# EAGLE design CONTROL circuit LED for Junction Box (EAGLE 9.4.2)
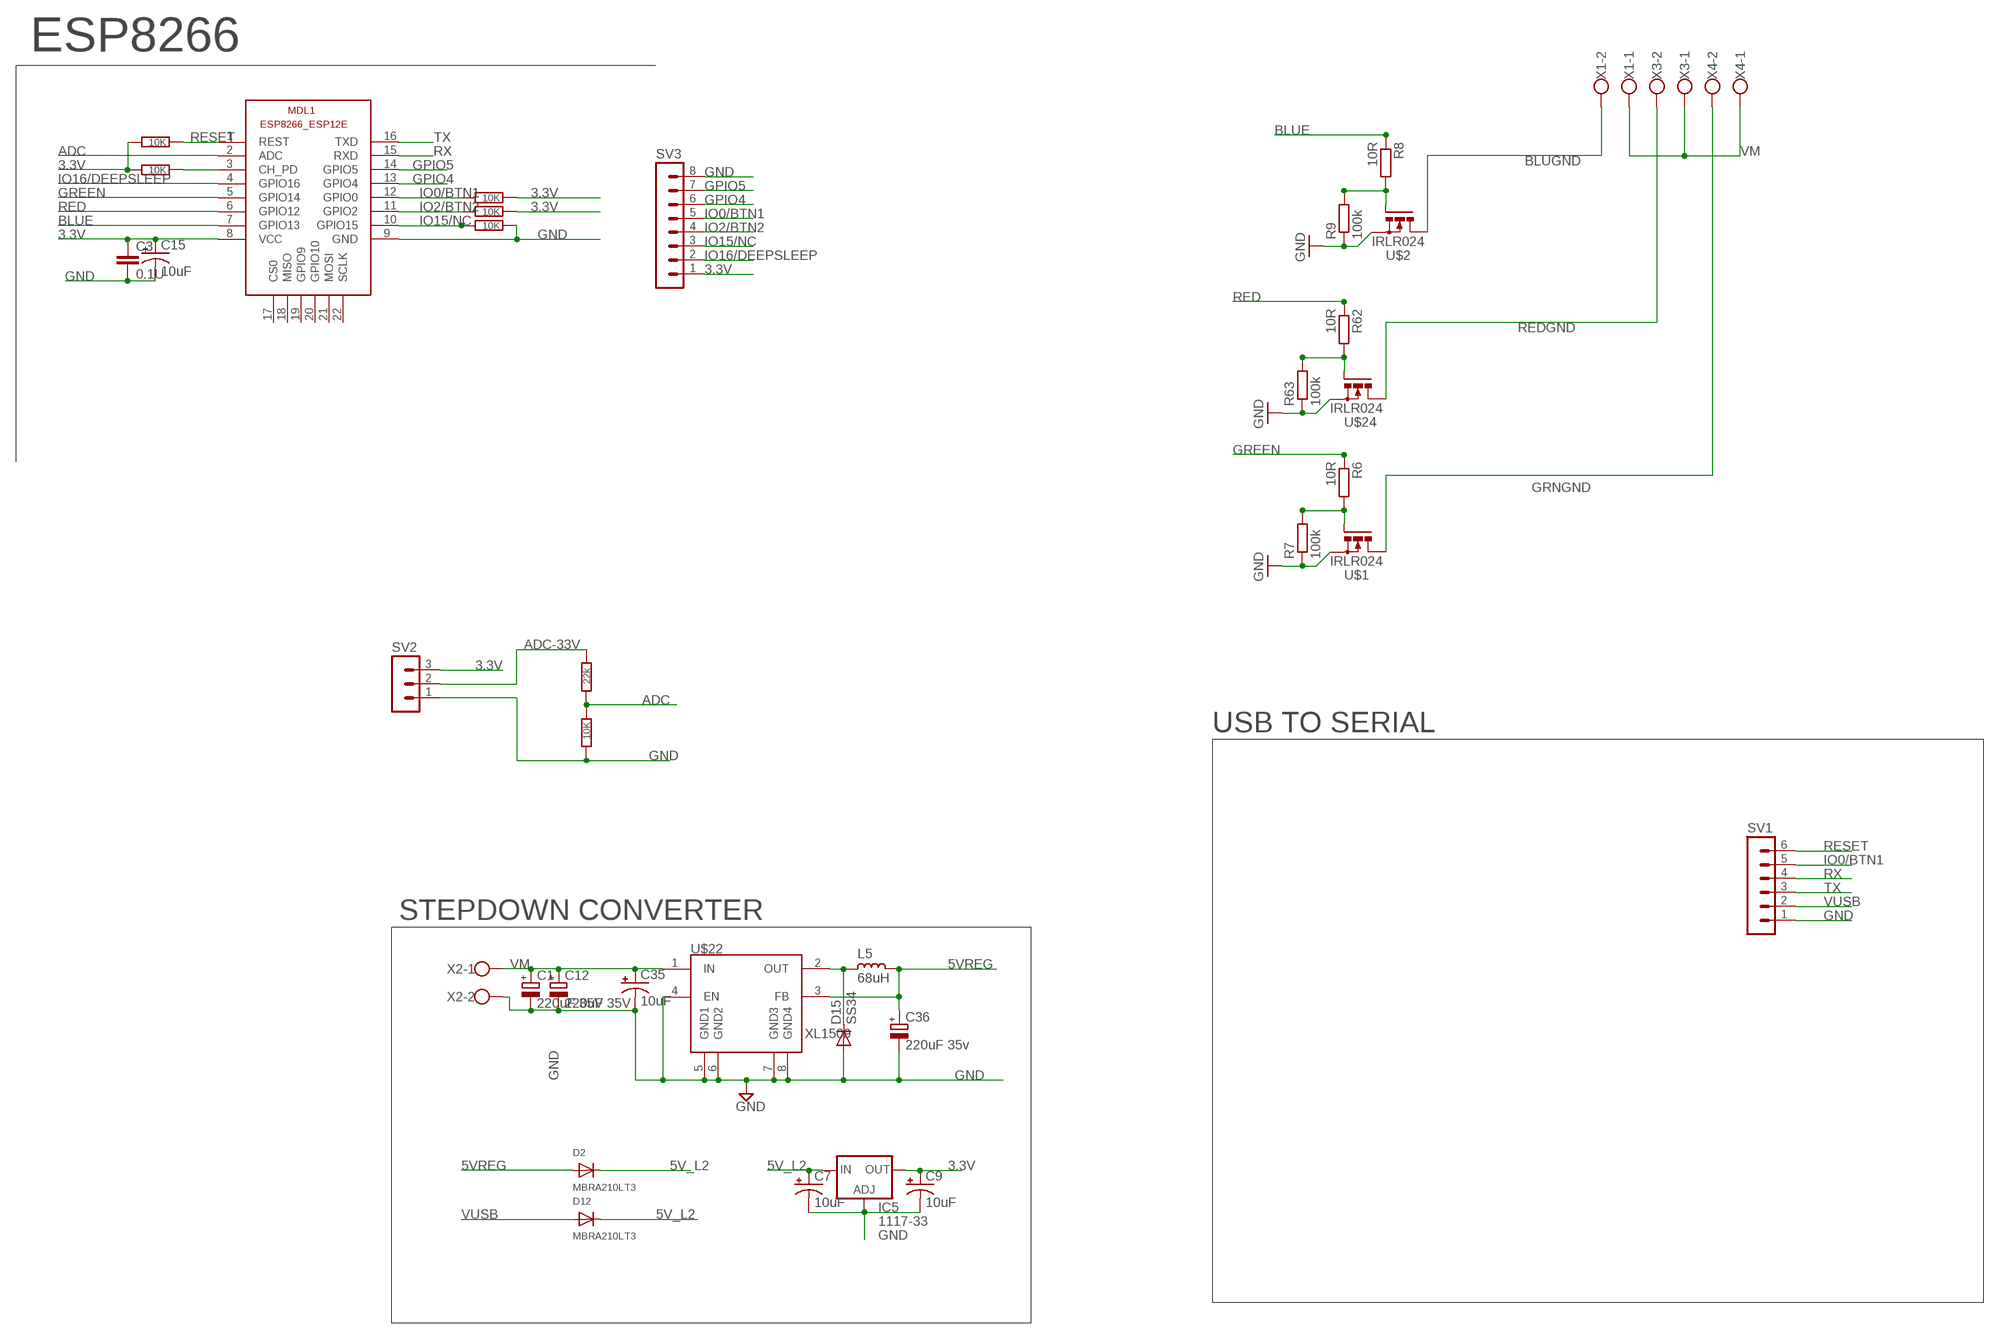
[diagram p0: schematic, sheet 1]

## Parts
C1  220uF 35V  CPOL-EUE3.5-8  [E3,5-8]
C3  0.1U  C-EUC1206  [C1206]
C7  10uF  CAP_POL1206  [EIA3216]
C9  10uF  CAP_POL1206  [EIA3216]
C12  220uF 35V  CPOL-EUE3.5-8  [E3,5-8]
C15  10uF  CAP_POL1206  [EIA3216]
C35  10uF  CAP_POL1206  [EIA3216]
C36  220uF 35v  CPOL-EUE3.5-8  [E3,5-8]
D2  MBRA210LT3  DIODESMA  [SMADIODE]
D12  MBRA210LT3  DIODESMA  [SMADIODE]
D15  SS34  DIODE-DO-214AC  [DO-214AC]
IC5  1117-33  LD117AS33TR  [SOT223]
L5  68uH  L_CD75  [CD75]
MDL1  ESP8266-12EESP8266-ESP12E  [ESP8266-ESP12E]
R3  22k  R-EU_R1206  [R1206]
R4  10K  R-EU_R1206  [R1206]
R6  10R  R-EU_R1206  [R1206]
R7  100k  R-EU_R1206  [R1206]
R8  10R  R-EU_R1206  [R1206]
R9  100k  R-EU_R1206  [R1206]
R11  10K  R-EU_R1206  [R1206]
R12  10K  R-EU_R1206  [R1206]
R28  10K  R-EU_R1206  [R1206]
R29  10K  R-EU_R1206  [R1206]
R31  10K  R-EU_R1206  [R1206]
R62  10R  R-EU_R1206  [R1206]
R63  100k  R-EU_R1206  [R1206]
SV1  MA06-1  [MA06-1]
SV2  MA03-1  [MA03-1]
SV3  MA08-1  [MA08-1]
U$1  IRLR024  N-POWER-MOSFETDPAK-MOSFET  [D-PAK_TO252AA]
U$2  IRLR024  N-POWER-MOSFETDPAK-MOSFET  [D-PAK_TO252AA]
U$22  XL1509  [SO08]
U$24  IRLR024  N-POWER-MOSFETDPAK-MOSFET  [D-PAK_TO252AA]
X1  W237-102  [W237-102]
X2  W237-102  [W237-102]
X3  W237-102  [W237-102]
X4  W237-102  [W237-102]

## Nets
3.3V: C3.1 C9.A(+) C15.A(+) IC5.4(OUT) MDL1.8(VCC) R11.2 R12.2 R28.1 R29.1 SV2.3 SV3.1
5V_L2: C7.A(+) D2.C D12.C IC5.3(IN)
5VREG: C36.+ D2.A L5.1 U$22.3(FB)
ADC: MDL1.2(ADC) R3.1 R4.2
ADC-33V: R3.2 SV2.2
BLUE: MDL1.7(GPIO13) R8.1
BLUGND: U$2.4(D) X1.2
GND: C1.- C3.2 C7.C(-) C9.C(-) C12.- C15.C(-) C35.C(-) C36.- D15.2(A) IC5.1(ADJ) MDL1.9(GND) R4.1 R7.1 R9.1 R31.2 R63.1 SV1.1 SV2.1 SV3.8 U$1.3(S) U$2.3(S) U$22.4(EN) U$22.5(GND1) U$22.6(GND2) U$22.7(GND3) U$22.8(GND4) U$24.3(S) X2.2
GPIO4: MDL1.13(GPIO4) SV3.6
GPIO5: MDL1.14(GPIO5) SV3.7
GREEN: MDL1.5(GPIO14) R6.1
GRNGND: U$1.4(D) X4.2
IO0/BTN1: MDL1.12(GPIO0) R12.1 SV1.5 SV3.5
IO2/BTN2: MDL1.11(GPIO2) R11.1 SV3.4
IO15/NC: MDL1.10(GPIO15) R31.1 SV3.3
IO16/DEEPSLEEP: MDL1.4(GPIO16) SV3.2
N$3: R62.2 R63.2 U$24.1(G)
N$4: D15.1(C) L5.2 U$22.2(OUT)
N$5: R6.2 R7.2 U$1.1(G)
N$7: R8.2 R9.2 U$2.1(G)
N$18: MDL1.3(CH_PD) R28.2
RED: MDL1.6(GPIO12) R62.1
REDGND: U$24.4(D) X3.2
RESET: MDL1.1(REST) R29.2 SV1.6
RX: MDL1.15(RXD) SV1.4
TX: MDL1.16(TXD) SV1.3
VM: C1.+ C12.+ C35.A(+) U$22.1(IN) X1.1 X2.1 X3.1 X4.1
VUSB: D12.A SV1.2
Unconnected: MDL1.17(CS0) MDL1.18(MISO) MDL1.19(GPIO9) MDL1.20(GPIO10) MDL1.21(MOSI) MDL1.22(SCLK)

## Notes on the sheet
- ESP8266
- USB TO SERIAL
- STEPDOWN CONVERTER

## Library data of the parts
C1 C12 C36 = rcl:CPOL-EU: POLARIZED CAPACITOR, European symbol
C3 = rcl:C-EU: CAPACITOR, European symbol
C7 C9 C15 C35 = SparkFun:CAP_POL: Capacitor Polarized These are standard SMD and PTH capacitors. Normally 10uF, 47uF, and 100uF in electrolytic and tantalum varieties. Always verify the external diameter of the through hole cap, it varies with capacity, voltage, and manufacturer. The EIA devices should be standard.
D2 D12 = microbuilder:DIODE: Diode SMADIODE - SMA Surface Mount Package 20V 1A Schottky Diode Digikey (500mV @ 1A, 500uA Vr @ 20V): 641-1014-6-ND 10V 2A Schottky Diode Digikey (350mV @ 2A, 700uA Vr @ 10V): MBRA210LT3 SOD-123 30V 200mA (800mV Vf, 2uA Vr @ 25V) Schottky Diode (very fast switching for boost, etc.) - Digikey: BAT54T1GOSTR-ND 30V 500mA (430mV Vf, 130uA Vr @ 30V) Schottky Diode - Digikey: B0530W-FDICT-ND MBR120 1A 20V (0.34Vf) Schottky Diode - Digikey: MBR120VLSFT1GOSCT-ND SOD-323 10V 570mA (380mV Vf, 3ns) Schottky Diode - Digikey: ZLLS410CT-ND 1N4148WS - 75V 150mA (1V Vf @ 10mA, 4ns) Simple Diode - Digikey: 1N4148WSFSCT-ND, Mouser: 512-1N4148WS SOD-523 BAT54 30V 200mA Schottky (0.8 Vf @ 100mA, 5ns) - Digikey: BAT54XV2CT-ND 30V 30mA Schottky Diode (RB751S-40TE61) - Digikey: RB751S-40TE61CT-ND SOT23-R/W - SOT23 Package (R = Solder Paste/Reflow Ovens, W = Hand-Soldering) BAT54Film 40V 300mA - Digikey: 497-7162-1-ND DO-1N4148 Through Hole Small Current Diode (any model)
D15 = dp_devices:DIODE: Various Diode Packages
IC5 = v-reg:LD117A?*: Low drop fixed and adjustable positive voltage regulators 1 A Source: http://www.st.com/stonline/products/literature/ds/7194/ld1117axx.pdf
L5 = rc-master-smd:L_: INDUCTOR
MDL1 = ESP8266-ESP12E:ESP8266-12E: ESP8266-12E with additional I/O and GPIO04/05 corrected The author cannot warrant that this library is free from error or will meet your specific requirements. Created by PuceBaboon.com. Komagane, Nagano, JAPAN
R3 R4 R11 R12 R28 R29 R31 = rcl:R-EU_: RESISTOR, European symbol
R6-R9 R62 R63 = resistor:R-EU_: RESISTOR, European symbol
SV1 = con-lstb:MA06-1: PIN HEADER; OC_FARNELL: unknown; OC_NEWARK: unknown
SV2 = con-lstb:MA03-1: PIN HEADER; OC_FARNELL: unknown; OC_NEWARK: unknown
SV3 = con-lstb:MA08-1: PIN HEADER; OC_FARNELL: unknown; OC_NEWARK: unknown
U$1 U$2 U$24 = Cohesion_parts:N-POWER-MOSFET
U$22 = Cohesion_parts:XL1509
X1-X4 = con-wago-500:W237-102: WAGO SCREW CLAMP; MPN: 237-102; OC_FARNELL: unknown; OC_NEWARK: 70K9898

## Board
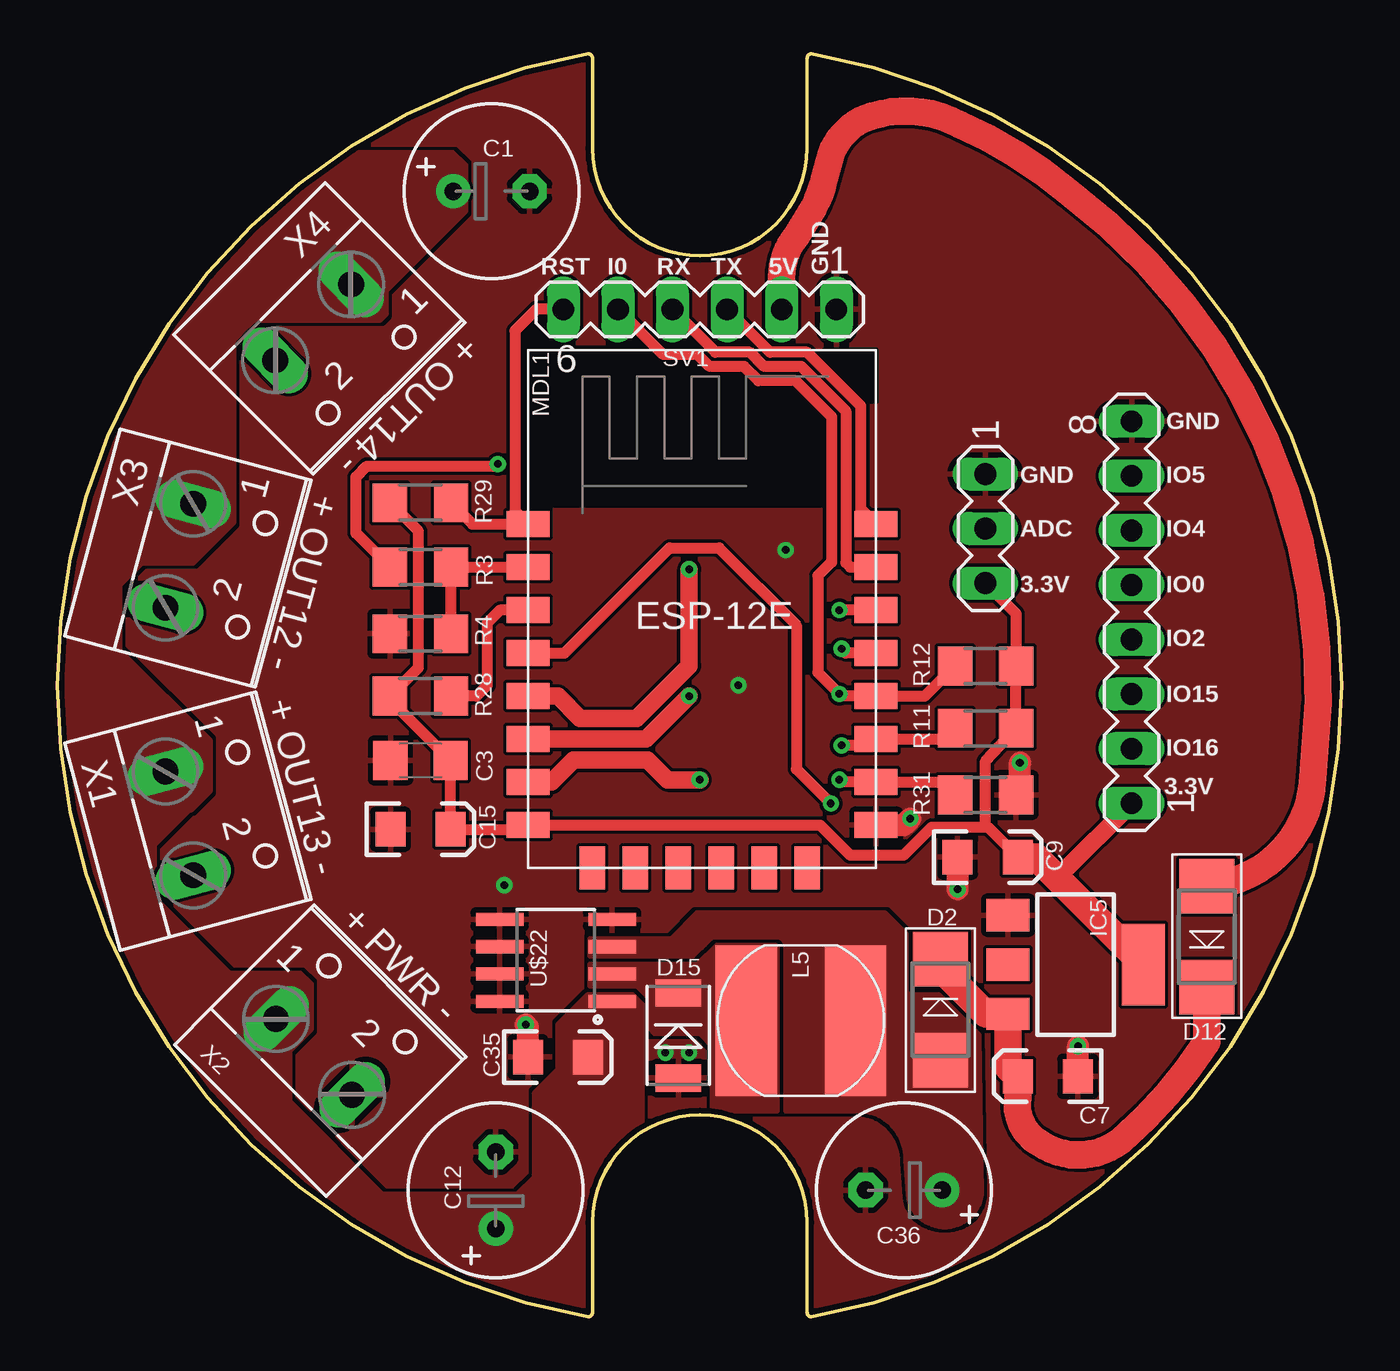
[diagram p1: board, top side]
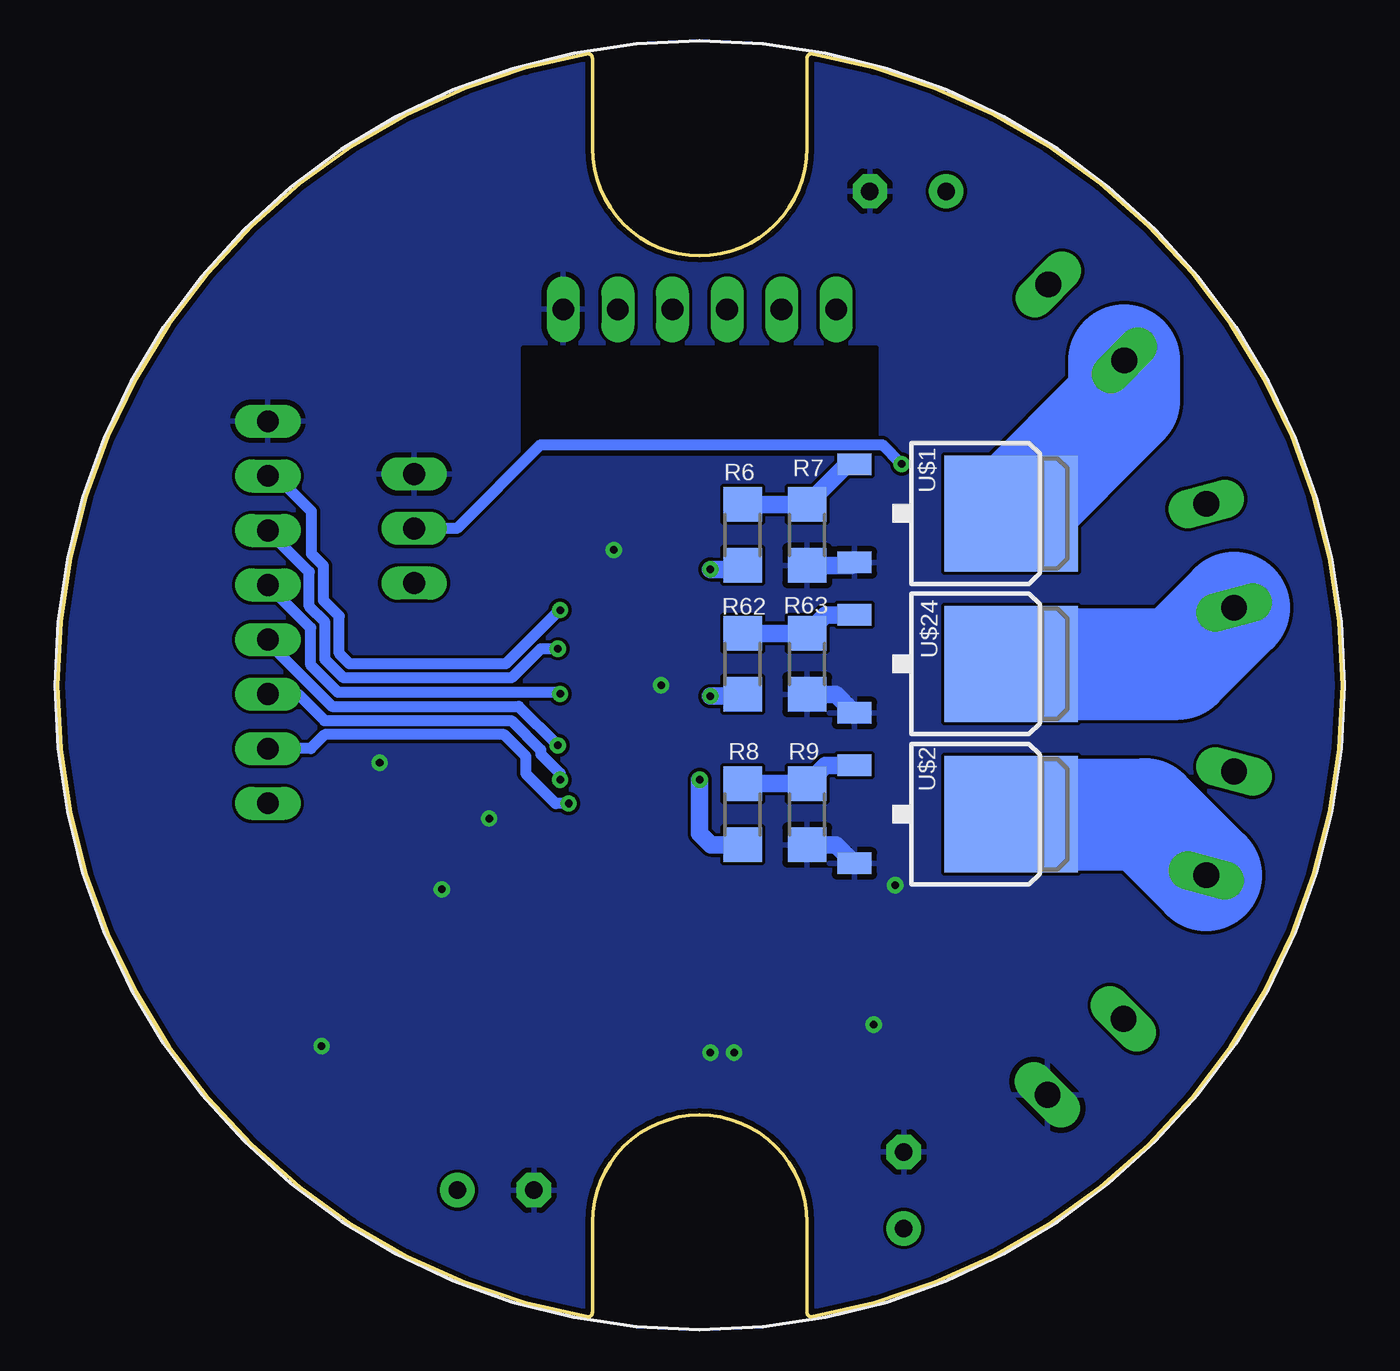
[diagram p2: board, bottom side, seen from below]

Size 59.78 x 58.8 mm. Coordinates in mm from the lower left corner, seen from the top.
Outline: 24.9,54.4 arc180 34.9,54.4 34.9,58.6 arc-90 35.1,58.8 arc-160 35.1,0 arc-90 34.9,0.2 34.9,4.4 arc180 24.9,4.4 24.9,0.2 arc-90 24.7,0 arc-160 24.7,58.8 arc-90 24.9,58.6 24.9,54.4
Copper layers (1*16): Top 0.035mm / dielectric 1.5mm / Bottom 0.035mm
Design rules "default *": minimum track width 6mil, minimum drill 0.35mm, track to track 6mil, track to pad 6mil, pad to pad 6mil, via to via 6mil, smd to smd 6mil, copper to edge 10mil, drill to drill 6mil, minimum pad ring 10mil, minimum via ring 8mil, stop-mask expansion 4mil, vias tented up to drill 0mil, thermal gap 10mil
tRestrict: area 21.9,37.8 to 35.5,45.1; area 35.7,42.6 to 38.1,45
bRestrict: area 21.7,40.2 to 38.1,45.1

### Footprints (pad centres in the part's own frame; a part is rotated, then mirrored left to right if it is on the bottom)
E3,5-8 = drill 0.813 pad 1.6: + -1.778,0 | drill 0.813 pad 1.6 octagon: - 1.778,0
C1206 = smd 1.6 x 1.8: 1 -1.4,0; 2 1.4,0
EIA3216 = smd 1.4 x 1.6: A 1.4,0; C -1.4,0
SMADIODE = smd 2.54 x 2.54: A 2.349,0; C -2.349,0
DO-214AC = smd 1.27 x 2.1: 1 -1.98,0; 2 1.98,0
SOT223 = smd 1.5 x 2: 1 -2.3,-3.15; 2 0,-3.15; 3 2.3,-3.15 | smd 3.8 x 2: 4 0,3.15
CD75 = smd 7 x 2.85: 1 0,2.54; 2 0,-2.54
ESP8266-ESP12E = smd 2 x 1.2: 1 0,16; 2 0,14; 3 0,12; 4 0,10; 5 0,8; 6 0,6; 7 0,4; 8 0,2; 9 16.2,2; 10 16.2,4; 11 16.2,6; 12 16.2,8; 13 16.2,10; 14 16.2,12; 15 16.2,14; 16 16.2,16 | smd 1.2 x 2: 17 11,0; 18 3,0; 19 5,0; 20 13,0; 21 7,0; 22 9,0
R1206 = smd 1.6 x 1.803: 1 -1.422,0; 2 1.422,0
MA06-1 = drill 1.016 long: 1 -6.35,0; 2 -3.81,0; 3 -1.27,0; 4 1.27,0; 5 3.81,0; 6 6.35,0
MA03-1 = drill 1.016 long: 1 -2.54,0; 2 0,0; 3 2.54,0
MA08-1 = drill 1.016 long: 1 -8.89,0; 2 -6.35,0; 3 -3.81,0; 4 -1.27,0; 5 1.27,0; 6 3.81,0; 7 6.35,0; 8 8.89,0
D-PAK_TO252AA = smd 1 x 1.6: 1 -2.28,-4.8; 3 2.28,-4.8 | smd 5.4 x 6.2: 4 0,2.5
SO08 = smd 0.61 x 2.21: 1 -1.905,-2.616; 2 -0.635,-2.616; 3 0.635,-2.616; 4 1.905,-2.616; 5 1.905,2.616; 6 0.635,2.616; 7 -0.635,2.616; 8 -1.905,2.616
W237-102 = drill 1.194 long: 1 -2.5,-1.27; 2 2.5,-1.27

### Placement (x,y rotation side)
C1  20.2,52.4 0 top
C3  16.9,25.9 180 top
C7  46.1,11.2 180 top
C9  43.3,21.4 0 top
C12  20.4,5.9 90 top
C15  16.9,22.7 0 top
C35  23.3,12.1 0 top
C36  39.4,5.9 180 top
D2  41.1,14.3 270 top
D12  53.5,17.7 90 top
D15  28.9,13.1 270 top
IC5  47.4,16.4 270 top
L5  34.6,13.8 270 top
MDL1  21.9,20.9 0 top
R3  16.9,34.9 180 top
R4  16.9,31.8 0 top
R6  27.9,36.4 90 bottom
R7  24.9,36.4 90 bottom
R8  27.9,23.4 90 bottom
R9  24.9,23.4 90 bottom
R11  43.2,27.4 0 top
R12  43.2,30.3 0 top
R28  16.9,28.9 0 top
R29  16.9,37.9 0 top
R31  43.2,24.3 0 top
R62  27.9,30.4 90 bottom
R63  24.9,30.4 90 bottom
SV1  29.9,46.9 180 top
SV2  43.2,36.7 270 top
SV3  50,32.8 90 top
U$1  17.9,37.4 270 bottom
U$2  17.9,23.4 270 bottom
U$22  23.2,16.6 90 top
U$24  17.9,30.4 270 bottom
X1  6.9,23.3 285 top
X2  12.84,13.01 315 top
X3  6.9,35.1 255 top
X4  12.8,45.4 225 top

### Tracks (layer width: path | path; a pad name or v marks a point on that pad's centre or on a via)
3.3V
  Top 0.508: R29.1 16.8,36.58 16.8,30.22 R28.1 15.48,28.72 C3.1 C15.A 21.7,22.7 MDL1.8 35.5,22.9 36.9,21.5 39.4,21.5 40.7,22.8 43.1,22.8 | C9.A 43.3,22.8 43.1,22.8 | 43.1,22.8 43.2,22.9 43.2,25.88 R11.2 R12.2 44.62,32.74 SV2.3
  Top 0.813: 46.72,20.22 46.72,20.63 SV3.1
  Top 1.27: IC5.4 46.72,20.22 45.55,21.4 C9.A
5V_L2
  Top 1.27: D12.C 53.5,12.8 arc-15 49.5,8.2 arc-72 45.7,8.1 arc-68 44.7,10.2 C7.A 44.25,11.65 IC5.3 43.22,14.1 41.1,16.22 D2.C
5VREG
  pour Top (rank 2, no thermals): 24.8,16.8 29.6,16.8 30.5,17.7 33.6,17.7 33.9,17.4 33.9,9.6 37.2,9.6 arc-94 39.5,7.3 39.6,5.7 arc166 43,5.7 42.9,13.1 41,15 39.6,15 39.5,15.1 39.5,17.8 38.5,18.8 29.8,18.8 28.6,17.6 24.8,17.6
ADC
  Top 0.508: R3.1 18.5,34.9 | 18.5,34.9 MDL1.2 | R4.2 18.32,34.72 18.5,34.9
ADC-33V  (via drill 0.35)
  Top 0.508: R3.2 13.9,36.48 13.9,39.1 14.4,39.6 20.4,39.6 v20.5,39.7
  Bottom 0.508: v20.5,39.7 21.4,40.6 37.3,40.6 41.2,36.7 SV2.2
BLUE  (via drill 0.35)
  Top 0.813: MDL1.7 23,24.9 24.03,25.93 27.46,25.93 28.4,25 v29.9,25
  Bottom 0.813: v29.9,25 29.9,22.5 29.38,21.98 R8.1
BLUGND
  Bottom 5.2: U$2.4 9.16,23.4 X1.2
GND  (via drill 0.35)
  Top 1.016: C9.C v41.9,19.9 | MDL1.9 39.4,22.9 v39.7,23.2 | R31.2 44.8,24.48 v44.8,25.8 | C7.C v47.5,12.6 | C35.C 21.9,13.5 v21.8,13.6
  Bottom 0.813: U$1.3 22.84,34.98 R7.1 | U$24.3 23.56,28.98 R63.1 | U$2.3 23.56,21.98 R9.1
  other vias: 28.3,12.3 29.4,12.3 33.9,35.7 31.7,29.4 20.8,20.1
  pour Top (rank 6): 28.9,59.4 arc176 28.9,-0.6 30.9,-0.6 arc176 30.9,59.4
  pour Bottom (rank 6): 28.9,59.4 arc176 28.9,-0.6 30.9,-0.6 arc176 30.9,59.4
GPIO4  (via drill 0.35)
  Top 0.508: MDL1.13 36.7,30.9 v36.5,31.1
  Bottom 0.508: v36.5,31.1 37.3,31.1 38.66,29.74 46.47,29.74 47.34,30.61 47.34,32.34 48.07,33.07 48.07,34.68 SV3.6
GPIO5  (via drill 0.35)
  Top 0.508: MDL1.14 v36.4,32.9
  Bottom 0.508: v36.4,32.9 36.43,32.9 38.93,30.4 46.19,30.4 46.68,30.88 46.68,32.62 47.41,33.35 47.41,34.95 47.97,35.51 47.97,37.49 49.62,39.15 SV3.7
GREEN  (via drill 0.35)
  Top 0.813: MDL1.5 23.3,28.9 24.33,27.86 26.96,27.86 29.4,30.3 v29.4,34.8
  Bottom 0.813: v29.4,34.8 28.08,34.8 R6.1
GRNGND
  Bottom 5.2: U$1.4 10.13,42.67 X4.2
IO0/BTN1  (via drill 0.35)
  Top 0.508: R12.1 40.38,28.9 MDL1.12 36.4,28.9 v36.4,29 35.4,30 35.4,34.5 36.03,35.13 36.03,41.9 34.35,43.58 32.62,43.58 31.96,44.24 30.35,44.24 29.79,44.8 28.19,44.8 SV1.5
  Bottom 0.508: v36.4,29 36.4,29.08 46.74,29.08 48,30.34 48,32.07 SV3.5
IO2/BTN2  (via drill 0.35)
  Top 0.508: R11.1 41.38,26.9 MDL1.11 37.8,26.6 v36.5,26.6
  Bottom 0.508: v36.5,26.6 38.32,28.42 47.01,28.42 50,31.4 SV3.4
IO15/NC  (via drill 0.35)
  Top 0.508: R31.1 41.18,24.9 MDL1.10 36.5,24.9 v36.4,25
  Bottom 0.508: SV3.3 48.6,28.99 47.37,27.76 38.66,27.76 37.3,26.4 37.3,26.2 36.4,25.3 v36.4,25
IO16/DEEPSLEEP  (via drill 0.35)
  Top 0.508: MDL1.4 23.6,30.9 28.5,35.8 30.8,35.8 34.4,32.2 34.4,25.5 v36,23.9
  Bottom 0.508: SV3.2 48,26.45 47.35,27.1 39,27.1 38,26.1 38,25.3 36.6,23.9 v36,23.9
N$3
  Bottom 0.813: U$24.1 24.04,32.68 R63.2 R62.2
N$4
  pour Top (no thermals): 24.8,15.4 27,15.4 27.6,14.8 27.6,13.4 27.8,13.2 29.9,13.2 30.5,12.6 30.5,9.6 33.5,9.6 33.5,17.2 33.4,17.3 30.7,17.3 29.8,16.4 24.8,16.4
N$5
  Bottom 0.813: U$1.1 23.04,39.68 R7.2 R6.2
N$7
  Bottom 0.813: U$2.1 24.04,25.68 R9.2 R8.2
N$18
  Top 0.508: MDL1.3 20.6,32.9 20,32.3 20,29.4 19.5,28.9 R28.2
RED  (via drill 0.35)
  Top 0.813: MDL1.6 27.4,26.9 v29.4,28.9
  Bottom 0.813: v29.4,28.9 27.98,28.9 R62.1
REDGND
  Bottom 5.2: U$24.4 7.64,30.4 X3.2
RESET
  Top 0.508: R29.2 19.32,36.9 MDL1.1 21.3,37.5 21.3,45.9 22.3,46.9 SV1.6
RX
  Top 0.508: SV1.4 30.63,44.9 32.23,44.9 32.89,44.24 34.62,44.24 36.69,42.17 36.69,35.11 36.9,34.9 MDL1.15
TX
  Top 0.508: MDL1.16 37.4,37.6 37.4,42.4 34.9,44.9 33.17,44.9 SV1.3
VM
  pour Top (rank 2, no thermals): 24.7,15 26.8,15 27.2,14.6 27.2,8.7 arc61 24.9,4.4 24.9,0.2 arc-23 14.4,4.1 arc-114 13.3,54.2 18.4,54.2 19,53.6 19,51.5 15.3,47.8 15.3,46.7 15,46.4 9.1,46.4 8.2,45.5 8.2,37 6.3,35.1 3.9,35.1 2.9,34.1 2.9,31 7.1,26.8 7.1,24.5 6.2,23.6 6.1,23.6 4.5,22 4.5,19.5 8,16 11.3,16 11.8,15.5 11.8,13.4 10.8,12.4 10.8,10 15.1,5.7 21.4,5.7 22.2,6.5 22.2,10.4 23.3,11.5 23.3,13.6
VUSB
  Top 1.27: D12.A arc83 58.44,25.11 58.7,28.6 arc54 47,52.4 arc16 42,55.5 arc45 37.9,55.9 arc53 36,54.1 35.7,53 arc-20 35,51.3 34.4,50.3 arc39 33.71,48.41 SV1.2

### Text on the board
tPlace: RST | I0 | RX | TX | 5V | GND | + OUT14 - | GND | + OUT12 - | GND | IO5 | ADC | IO4 | 3.3V | IO0 | IO2 | + OUT13 - | IO15 | IO16 | 3.3V | + PWR -